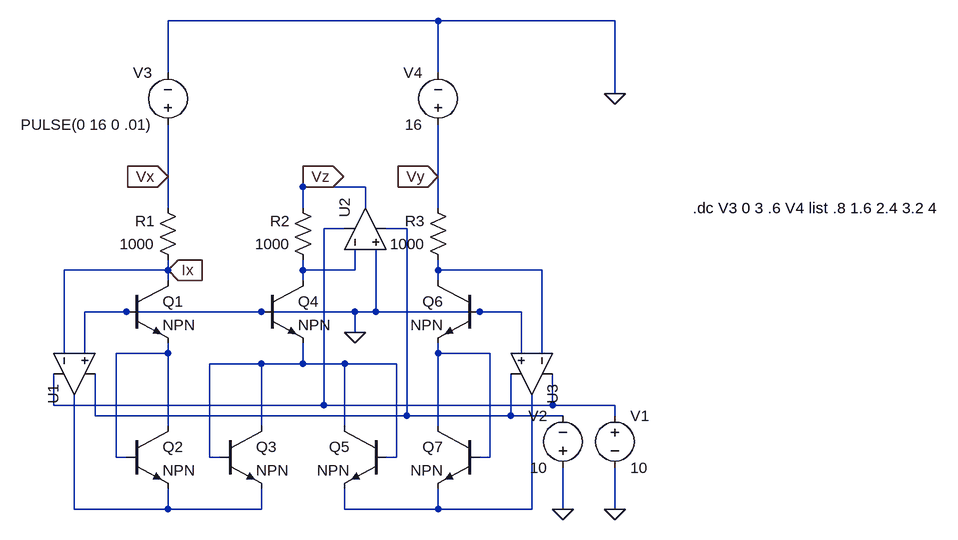
[diagram p0: schematic Postlab4.asc]
Postlab4.asc, the LTspice schematic file:
Version 4
SHEET 1 1272 680
WIRE 416 -320 0 -320
WIRE 688 -320 416 -320
WIRE 0 -240 0 -320
WIRE 416 -240 416 -320
WIRE 688 -208 688 -320
WIRE 0 -80 0 -160
WIRE 208 -80 208 -96
WIRE 416 -80 416 -160
WIRE 208 -64 208 -80
WIRE 304 -64 208 -64
WIRE 0 -32 0 -80
WIRE 208 -32 208 -64
WIRE 304 -32 304 -64
WIRE 416 -32 416 -80
WIRE 272 0 240 0
WIRE 368 0 336 0
WIRE 0 64 0 48
WIRE 0 64 -160 64
WIRE 208 64 208 48
WIRE 288 64 288 32
WIRE 288 64 208 64
WIRE 416 64 416 48
WIRE 576 64 416 64
WIRE 0 80 0 64
WIRE 208 80 208 64
WIRE 416 80 416 64
WIRE -64 128 -128 128
WIRE 144 128 -64 128
WIRE 288 128 144 128
WIRE 320 128 320 32
WIRE 320 128 288 128
WIRE 480 128 320 128
WIRE 544 128 480 128
WIRE 288 160 288 128
WIRE -160 192 -160 64
WIRE -128 192 -128 128
WIRE 0 192 0 176
WIRE 0 192 -80 192
WIRE 416 192 416 176
WIRE 496 192 416 192
WIRE 544 192 544 128
WIRE 576 192 576 64
WIRE 144 208 64 208
WIRE 208 208 208 176
WIRE 208 208 144 208
WIRE 272 208 208 208
WIRE 352 208 272 208
WIRE -176 272 -176 224
WIRE 240 272 240 0
WIRE 240 272 -176 272
WIRE 592 272 592 224
WIRE 592 272 240 272
WIRE 688 272 592 272
WIRE -112 288 -112 224
WIRE 368 288 368 0
WIRE 368 288 -112 288
WIRE 528 288 528 224
WIRE 528 288 368 288
WIRE 608 288 528 288
WIRE 688 288 688 272
WIRE 0 304 0 192
WIRE 144 304 144 208
WIRE 272 304 272 208
WIRE 416 304 416 192
WIRE -80 352 -80 192
WIRE -64 352 -80 352
WIRE 64 352 64 208
WIRE 80 352 64 352
WIRE 352 352 352 208
WIRE 352 352 336 352
WIRE 496 352 496 192
WIRE 496 352 480 352
WIRE -144 432 -144 256
WIRE 0 432 0 400
WIRE 0 432 -144 432
WIRE 144 432 144 400
WIRE 144 432 0 432
WIRE 272 432 272 400
WIRE 416 432 416 400
WIRE 416 432 272 432
WIRE 560 432 560 256
WIRE 560 432 416 432
WIRE 608 432 608 368
WIRE 688 432 688 368
FLAG 288 160 0
FLAG 0 -80 Vx
IOPIN 0 -80 In
FLAG 416 -80 Vy
IOPIN 416 -80 In
FLAG 208 -80 Vz
IOPIN 208 -80 Out
FLAG 0 64 Ix
IOPIN 0 64 In
FLAG 688 432 0
FLAG 608 432 0
FLAG 688 -208 0
SYMBOL res 16 64 R180
WINDOW 0 36 76 Left 2
WINDOW 3 36 40 Left 2
SYMATTR InstName R1
SYMATTR Value 1000
SYMBOL res 224 64 R180
WINDOW 0 36 76 Left 2
WINDOW 3 36 40 Left 2
SYMATTR InstName R2
SYMATTR Value 1000
SYMBOL res 432 64 R180
WINDOW 0 36 76 Left 2
WINDOW 3 36 40 Left 2
SYMATTR InstName R3
SYMATTR Value 1000
SYMBOL UniversalOpamp2 -144 224 M90
SYMATTR InstName U1
SYMBOL UniversalOpamp2 304 0 R270
SYMATTR InstName U2
SYMBOL UniversalOpamp2 560 224 R90
SYMATTR InstName U3
SYMBOL npn -64 80 R0
SYMATTR InstName Q1
SYMBOL npn -64 304 R0
SYMATTR InstName Q2
SYMBOL npn 80 304 R0
SYMATTR InstName Q3
SYMBOL npn 144 80 R0
SYMATTR InstName Q4
SYMBOL npn 336 304 M0
SYMATTR InstName Q5
SYMBOL npn 480 80 M0
SYMATTR InstName Q6
SYMBOL npn 480 304 M0
SYMATTR InstName Q7
SYMBOL voltage 688 272 R0
SYMATTR InstName V1
SYMATTR Value 10
SYMBOL voltage 608 384 R180
WINDOW 0 24 96 Left 2
WINDOW 3 24 16 Left 2
SYMATTR InstName V2
SYMATTR Value 10
SYMBOL voltage 0 -144 R180
WINDOW 0 24 96 Left 2
WINDOW 3 24 16 Left 2
SYMATTR InstName V3
SYMATTR Value PULSE(0 16 0 .01)
SYMBOL voltage 416 -144 R180
WINDOW 0 24 96 Left 2
WINDOW 3 24 16 Left 2
SYMATTR InstName V4
SYMATTR Value 16
TEXT 808 -32 Left 2 !.dc V3 0 3 .6 V4 list .8 1.6 2.4 3.2 4

The netlist it stands for:
* Postlab4.asc
R1 Ix Vx 1000
R2 N003 Vz 1000
R3 N004 Vy 1000
XU1 0 Ix N001 N002 N008 level.2 Avol=1Meg GBW=10Meg Slew=10Meg ilimit=25m rail=0 Vos=0 phimargin=45 en=0 enk=0 in=0 ink=0 Rin=500Meg  ; pins IN+ IN- V+ V- OUT
XU2 0 N003 N001 N002 Vz level.2 Avol=1Meg GBW=10Meg Slew=10Meg ilimit=25m rail=0 Vos=0 phimargin=45 en=0 enk=0 in=0 ink=0 Rin=500Meg  ; pins IN+ IN- V+ V- OUT
XU3 0 N004 N001 N002 N009 level.2 Avol=1Meg GBW=10Meg Slew=10Meg ilimit=25m rail=0 Vos=0 phimargin=45 en=0 enk=0 in=0 ink=0 Rin=500Meg  ; pins IN+ IN- V+ V- OUT
Q1 Ix 0 N005 0 NPN
Q2 N005 N005 N008 0 NPN
Q3 N007 N007 N008 0 NPN
Q4 N003 0 N007 0 NPN
Q5 N007 N007 N009 0 NPN
Q6 N004 0 N006 0 NPN
Q7 N006 N006 N009 0 NPN
V1 N001 0 10
V2 0 N002 10
V3 Vx 0 PULSE(0 16 0 .01)
V4 Vy 0 16
.model NPN NPN
.model PNP PNP
.lib standard.bjt
.dc V3 0 3 .6 V4 list .8 1.6 2.4 3.2 4
.lib UniversalOpamps2.sub
.backanno
.end